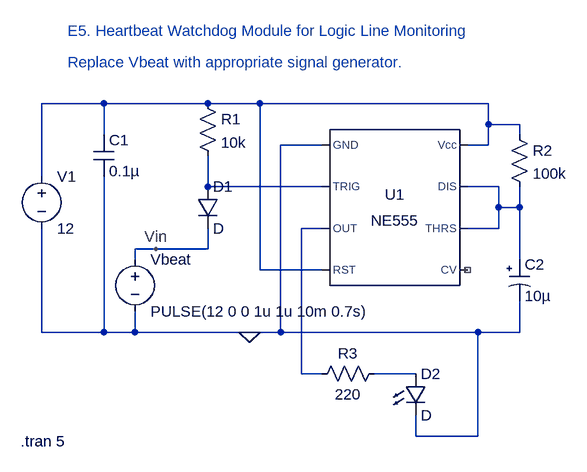
[diagram p0: schematic Watchdog Module .asc]
Watchdog Module .asc, the LTspice schematic file:
Version 4
SHEET 1 880 680
WIRE -144 0 -240 0
WIRE 16 0 -144 0
WIRE 96 0 16 0
WIRE 448 0 96 0
WIRE 448 32 448 0
WIRE 496 32 448 32
WIRE -144 48 -144 0
WIRE 496 48 496 32
WIRE 192 64 128 64
WIRE 448 64 448 32
WIRE 448 64 416 64
WIRE -240 112 -240 0
WIRE 16 128 16 80
WIRE 192 128 16 128
WIRE 464 128 416 128
WIRE 464 160 464 128
WIRE 496 160 496 128
WIRE 496 160 464 160
WIRE 192 192 160 192
WIRE 464 192 464 160
WIRE 464 192 416 192
WIRE -64 224 -96 224
WIRE 16 224 16 192
WIRE 16 224 -64 224
WIRE -96 240 -96 224
WIRE 496 240 496 160
WIRE 96 256 96 0
WIRE 192 256 96 256
WIRE -240 352 -240 192
WIRE -144 352 -144 112
WIRE -144 352 -240 352
WIRE -96 352 -96 320
WIRE -96 352 -144 352
WIRE 80 352 -96 352
WIRE 128 352 128 64
WIRE 128 352 80 352
WIRE 432 352 128 352
WIRE 496 352 496 304
WIRE 496 352 432 352
WIRE 160 416 160 192
WIRE 192 416 160 416
WIRE 336 416 272 416
WIRE 336 512 336 480
WIRE 432 512 432 352
WIRE 432 512 336 512
FLAG 80 352 0
FLAG -64 224 Vin
SYMBOL Misc\\NE555 304 160 R0
SYMATTR InstName U1
SYMBOL voltage -240 96 R0
SYMATTR InstName V1
SYMATTR Value 12
SYMBOL cap -160 48 R0
SYMATTR InstName C1
SYMATTR Value 0.1µ
SYMBOL res 0 -16 R0
SYMATTR InstName R1
SYMATTR Value 10k
SYMBOL voltage -96 224 R0
WINDOW 123 0 0 Left 0
WINDOW 39 0 0 Left 0
SYMATTR InstName Vbeat
SYMATTR Value PULSE(12 0 0 1u 1u 10m 0.7s)
SYMBOL res 480 32 R0
SYMATTR InstName R2
SYMATTR Value 100k
SYMBOL polcap 480 240 R0
SYMATTR InstName C2
SYMATTR Value 10µ
SYMBOL res 288 400 R90
WINDOW 0 0 56 VBottom 2
WINDOW 3 32 56 VTop 2
SYMATTR InstName R3
SYMATTR Value 220
SYMBOL LED 320 416 R0
SYMATTR InstName D2
SYMBOL diode 0 128 R0
SYMATTR InstName D1
TEXT -272 520 Left 2 !.tran 5
TEXT -200 -112 Left 2 ;E5. Heartbeat Watchdog Module for Logic Line Monitoring
TEXT -200 -64 Left 2 ;Replace Vbeat with appropriate signal generator.

The netlist it stands for:
* Watchdog Module .asc
XU1 0 N002 N004 N001 NC_01 N003 N003 N001 NE555  ; pins GND TRIG OUT RST CV THRS DIS Vcc
V1 N001 0 12
C1 N001 0 0.1µ
R1 N001 N002 10k
Vbeat Vin 0 PULSE(12 0 0 1u 1u 10m 0.7s)
R2 N001 N003 100k
C2 N003 0 10µ
R3 N005 N004 220
D2 N005 0 D
D1 N002 Vin D
.model D D
.lib standard.dio
.tran 5
* E5. Heartbeat Watchdog Module for Logic Line Monitoring
* Replace Vbeat with appropriate signal generator.
.lib NE555.sub
.backanno
.end